# Altium schematic sheet Input Filter.SchDoc
size A4
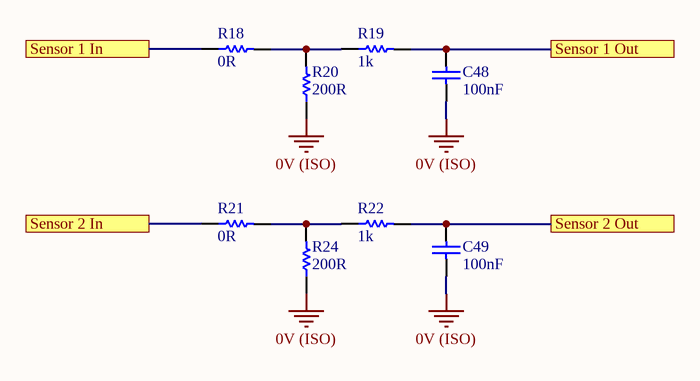
[diagram p0: Input Filter.SchDoc]

## Parts
C48  100nF  [0805]
C49  100nF  [0805]
R18  0R  [0805]
R19  1k  [0805]
R20  200R  [0805]
R21  0R  [0805]
R22  1k  [0805]
R24  200R  [0805]

## Ports
Sensor 1 In, Sensor 1 Out, Sensor 2 In, Sensor 2 Out

## Nets
0V (ISO): C48.1 C49.1 R20.1 R24.1
Sensor 1 In: R18.1 ; port Sensor 1 In
Sensor 1 Out: C48.2 R19.2 ; port Sensor 1 Out
Sensor 2 In: R21.1 ; port Sensor 2 In
Sensor 2 Out: C49.2 R22.2 ; port Sensor 2 Out
NetR18_2: R18.2 R19.1 R20.2
NetR21_2: R21.2 R22.1 R24.2

## Library data of the parts
C48 C49 = GCM21BR71E104KA37L: Manufacturer: muRata; Tolerance: 10%; Material: X7R; Rated Voltage: 25V; Part Number: GCM21BR71E104KA37L; Value: 100nF
R18 R21 = RC0805FR070RL: Manufacturer: YAGEO; Tolerance: 0.01; Rated Voltage: 0.125W; Part Number: RC0805FR070RL; Value: 0R; Material: FR-07
R19 R22 = RC0805FR071KL: Manufacturer: YAGEO; Tolerance: 0.01; Rated Voltage: 0.125W; Part Number: RC0805FR071KL; Value: 1k; Material: FR-07
R20 R24 = RC0805FR07200RL: Manufacturer: YAGEO; Tolerance: 0.01; Rated Voltage: 0.125W; Part Number: RC0805FR07200RL; Value: 200R; Material: FR-07